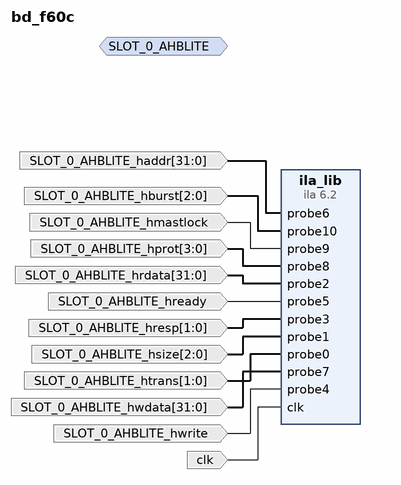
[diagram p0: block diagram of the top level]
# Vivado block design bd_f60c, xczu7ev-ffvc1156-2-e, Vivado 2022.2
create_bd_design bd_f60c

create_bd_intf_port -mode Monitor -vlnv xilinx.com:interface:ahblite_rtl:2.0 SLOT_0_AHBLITE
create_bd_port -dir I -type clk clk
create_bd_port -dir I -from 1 -to 0 SLOT_0_AHBLITE_htrans
create_bd_port -dir I -from 2 -to 0 SLOT_0_AHBLITE_hsize
create_bd_port -dir I -from 31 -to 0 SLOT_0_AHBLITE_hrdata
create_bd_port -dir I -from 1 -to 0 SLOT_0_AHBLITE_hresp
create_bd_port -dir I SLOT_0_AHBLITE_hwrite
create_bd_port -dir I SLOT_0_AHBLITE_hready
create_bd_port -dir I -from 31 -to 0 SLOT_0_AHBLITE_haddr
create_bd_port -dir I -from 31 -to 0 SLOT_0_AHBLITE_hwdata
create_bd_port -dir I -from 3 -to 0 SLOT_0_AHBLITE_hprot
create_bd_port -dir I SLOT_0_AHBLITE_hmastlock
create_bd_port -dir I -from 2 -to 0 SLOT_0_AHBLITE_hburst

create_bd_cell -type ip -vlnv xilinx.com:ip:ila:6.2 ila_lib
set_property -dict [list \
  CONFIG.ALL_PROBE_SAME_MU TRUE \
  CONFIG.ALL_PROBE_SAME_MU_CNT 1 \
  CONFIG.C_ADV_TRIGGER FALSE \
  CONFIG.C_DATA_DEPTH 4096 \
  CONFIG.C_EN_STRG_QUAL 0 \
  CONFIG.C_EN_TIME_TAG 0 \
  CONFIG.C_ILA_CLK_FREQ 100000000 \
  CONFIG.C_INPUT_PIPE_STAGES 0 \
  CONFIG.C_MONITOR_TYPE Native \
  CONFIG.C_NUM_OF_PROBES 11 \
  CONFIG.C_PROBE0_TYPE 0 \
  CONFIG.C_PROBE0_WIDTH 2 \
  CONFIG.C_PROBE10_TYPE 0 \
  CONFIG.C_PROBE10_WIDTH 3 \
  CONFIG.C_PROBE1_TYPE 0 \
  CONFIG.C_PROBE1_WIDTH 3 \
  CONFIG.C_PROBE2_TYPE 0 \
  CONFIG.C_PROBE2_WIDTH 32 \
  CONFIG.C_PROBE3_TYPE 0 \
  CONFIG.C_PROBE3_WIDTH 2 \
  CONFIG.C_PROBE4_TYPE 0 \
  CONFIG.C_PROBE4_WIDTH 1 \
  CONFIG.C_PROBE5_TYPE 0 \
  CONFIG.C_PROBE5_WIDTH 1 \
  CONFIG.C_PROBE6_TYPE 0 \
  CONFIG.C_PROBE6_WIDTH 32 \
  CONFIG.C_PROBE7_TYPE 0 \
  CONFIG.C_PROBE7_WIDTH 32 \
  CONFIG.C_PROBE8_TYPE 0 \
  CONFIG.C_PROBE8_WIDTH 4 \
  CONFIG.C_PROBE9_TYPE 0 \
  CONFIG.C_PROBE9_WIDTH 1 \
  CONFIG.C_TIME_TAG_WIDTH 32 \
  CONFIG.C_TRIGIN_EN false \
  CONFIG.C_TRIGOUT_EN false \
  CONFIG.C_XLNX_HW_PROBE_INFO DEFAULT \
] [get_bd_cells ila_lib]

# ---- connections ----

connect_bd_net [get_bd_ports SLOT_0_AHBLITE_haddr] [get_bd_pins ila_lib/probe6]
connect_bd_net [get_bd_ports SLOT_0_AHBLITE_hburst] [get_bd_pins ila_lib/probe10]
connect_bd_net [get_bd_ports SLOT_0_AHBLITE_hmastlock] [get_bd_pins ila_lib/probe9]
connect_bd_net [get_bd_ports SLOT_0_AHBLITE_hprot] [get_bd_pins ila_lib/probe8]
connect_bd_net [get_bd_ports SLOT_0_AHBLITE_hrdata] [get_bd_pins ila_lib/probe2]
connect_bd_net [get_bd_ports SLOT_0_AHBLITE_hready] [get_bd_pins ila_lib/probe5]
connect_bd_net [get_bd_ports SLOT_0_AHBLITE_hresp] [get_bd_pins ila_lib/probe3]
connect_bd_net [get_bd_ports SLOT_0_AHBLITE_hsize] [get_bd_pins ila_lib/probe1]
connect_bd_net [get_bd_ports SLOT_0_AHBLITE_htrans] [get_bd_pins ila_lib/probe0]
connect_bd_net [get_bd_ports SLOT_0_AHBLITE_hwdata] [get_bd_pins ila_lib/probe7]
connect_bd_net [get_bd_ports SLOT_0_AHBLITE_hwrite] [get_bd_pins ila_lib/probe4]
connect_bd_net [get_bd_ports clk] [get_bd_pins ila_lib/clk]

validate_bd_design
save_bd_design
